# EAGLE design Qwiic_Spectral_Sensor_AS7341 (EAGLE 9.6.2)
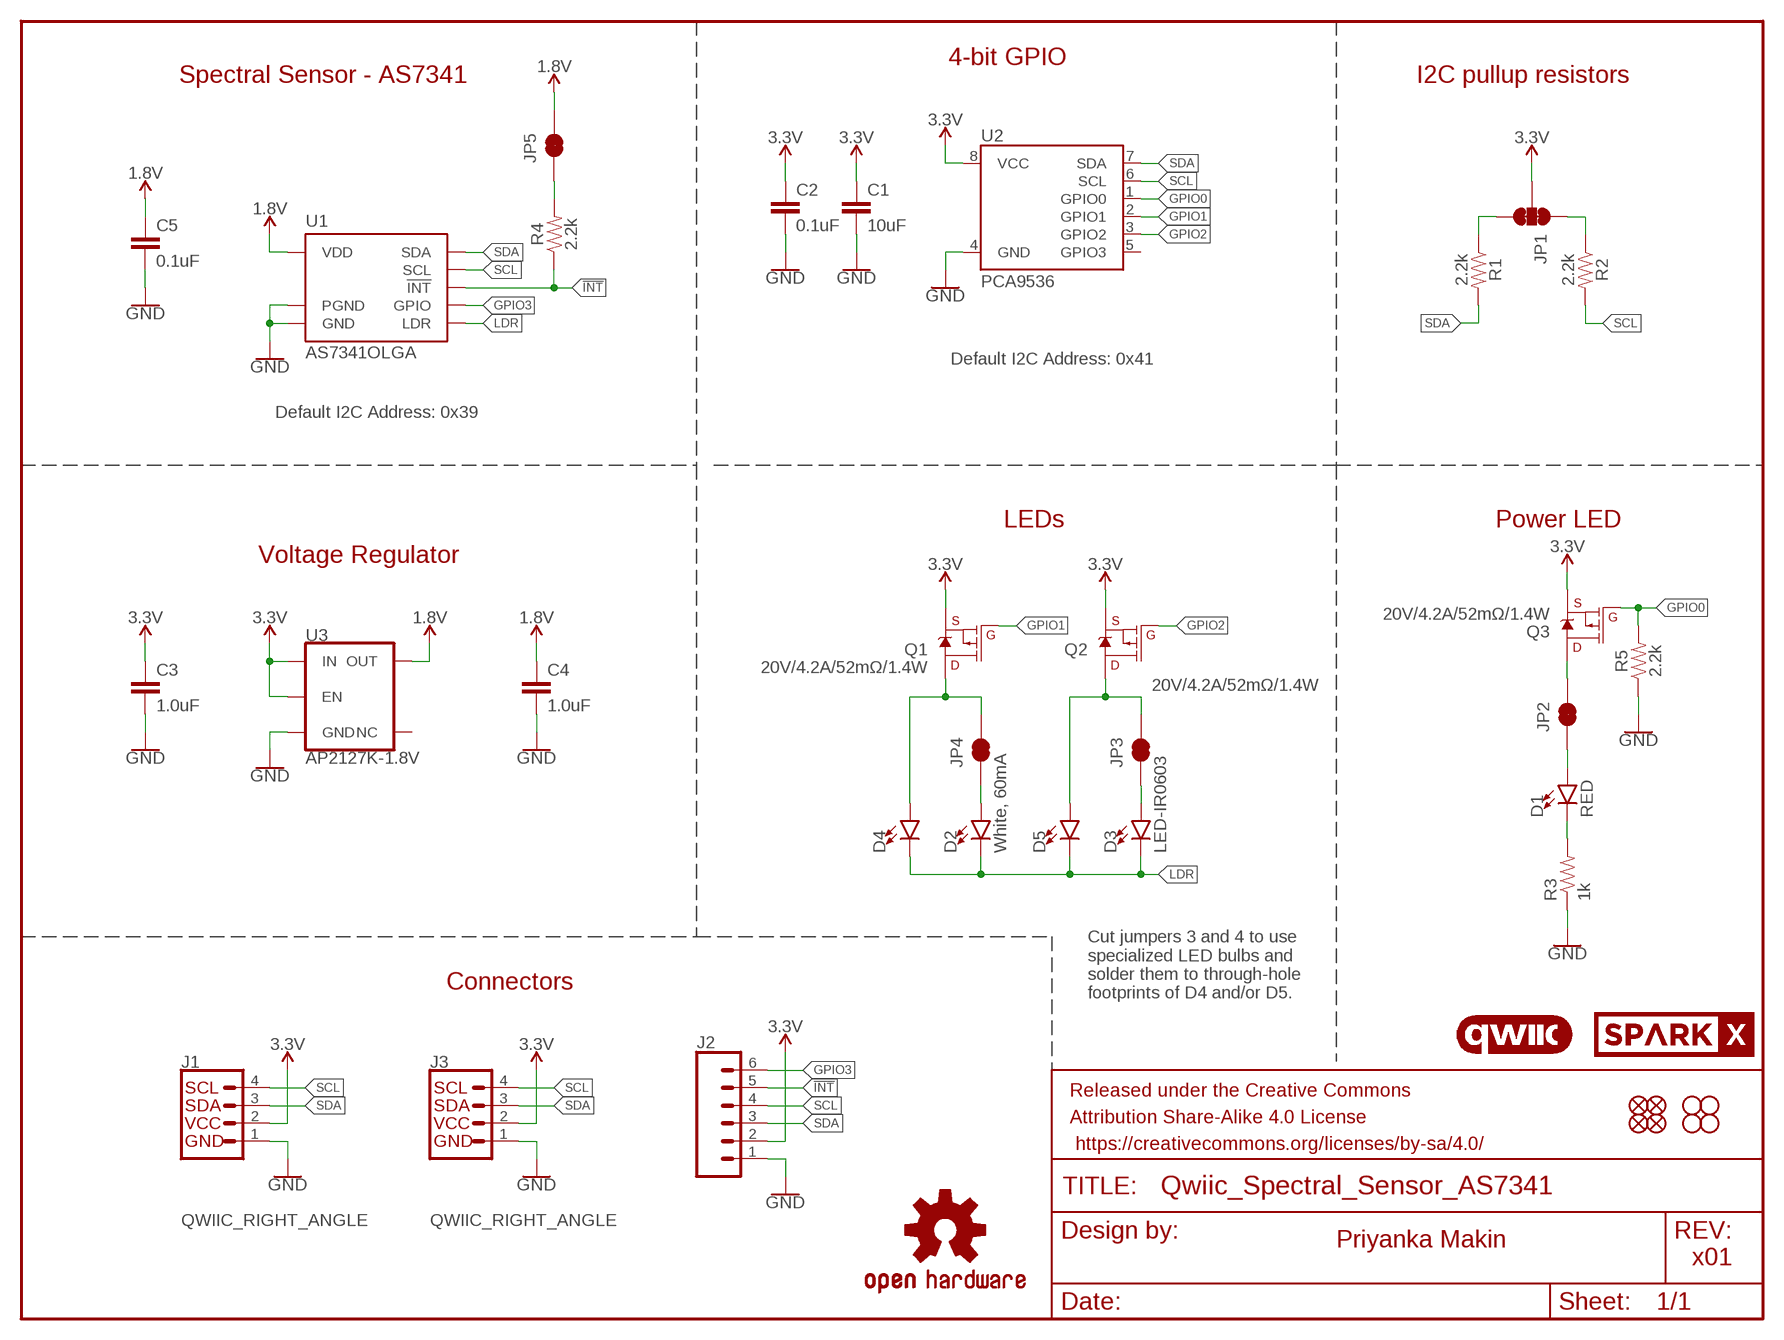
[diagram p0: schematic, sheet 1]

## Parts
C1  10uF  10UF-0603-6.3V-20%  [0603]
C2  0.1uF  0.1UF-0603-25V-(+80/-20%)  [0603]
C3  1.0uF  1.0UF-0603-16V-10%  [0603]
C4  1.0uF  1.0UF-0603-16V-10%  [0603]
C5  0.1uF  0.1UF-0603-25V-(+80/-20%)  [0603]
D1  RED  LED-RED0603  [LED-0603]
D2  White, 60mA  LED-WHITE3014  [SUPER_BRIGHT_SMD_LED_3014]
D3  LED-IR0603  [LED-0603]
D4  LED-3MM-NO_SILK  [LED_3MM-NS]
D5  LED-3MM-NO_SILK  [LED_3MM-NS]
FD1  FIDUCIAL1X2  [FIDUCIAL-1X2]
FD2  FIDUCIAL1X2  [FIDUCIAL-1X2]
FD3  FIDUCIAL1X2  [FIDUCIAL-1X2]
FD4  FIDUCIAL1X2  [FIDUCIAL-1X2]
FRAME1  FRAME-LETTER  [CREATIVE_COMMONS]
H1  STAND-OFF  [STAND-OFF]
H2  STAND-OFF  [STAND-OFF]
H3  STAND-OFF  [STAND-OFF]
H4  STAND-OFF  [STAND-OFF]
J1  QWIIC_RIGHT_ANGLE  QWIIC_CONNECTORJS-1MM  [JST04_1MM_RA]
J2  CONN_06NO_SILK_FEMALE_PTH  [1X06_NO_SILK]
J3  QWIIC_RIGHT_ANGLE  QWIIC_CONNECTORJS-1MM  [JST04_1MM_RA]
JP1  JUMPER-SMT_3_2-NC_TRACE_SILK  [SMT-JUMPER_3_2-NC_TRACE_SILK]
JP2  JUMPER-SMT_2_NC_TRACE_SILK  [SMT-JUMPER_2_NC_TRACE_SILK]
JP3  JUMPER-SMT_2_NC_TRACE_SILK  [SMT-JUMPER_2_NC_TRACE_SILK]
JP4  JUMPER-SMT_2_NC_TRACE_SILK  [SMT-JUMPER_2_NC_TRACE_SILK]
JP5  JUMPER-SMT_2_NC_TRACE_SILK  [SMT-JUMPER_2_NC_TRACE_SILK]
LOGO1  QWIIC_LOGO_6MM  [QWIIC_6MM]
Q1  20V/4.2A/52mΩ/1.4W  MOSFET_PCH-DMG2305UX-7  [SOT23-3]
Q2  20V/4.2A/52mΩ/1.4W  MOSFET_PCH-DMG2305UX-7  [SOT23-3]
Q3  20V/4.2A/52mΩ/1.4W  MOSFET_PCH-DMG2305UX-7  [SOT23-3]
R1  2.2k  2.2KOHM-0603-1/10W-1%  [0603]
R2  2.2k  2.2KOHM-0603-1/10W-1%  [0603]
R3  1k  1KOHM-0603-1/10W-1%  [0603]
R4  2.2k  2.2KOHM-0603-1/10W-1%  [0603]
R5  2.2k  2.2KOHM-0603-1/10W-1%  [0603]
U1  AS7341OLGA  [OLGA8]
U2  PCA9536  [MSOP8]
U3  AP2127K-1.8V  V_REG_AP2127K-1.8V  [SOT23-5]
U$1  OSHW-LOGOS  [OSHW-LOGO-S]
U$31  SPARKX-LOGO3  [SPARKX-SMALL]

## Nets
1.8V: C4.1 C5.1 JP5.2 U1.1(VDD) U3.5(OUT)
3.3V: C1.1 C2.1 C3.1 J1.2 J2.2 J3.2 JP1.2 Q1.2(S) Q2.2(S) Q3.2(S) U2.8(VCC) U3.1(IN) U3.3(EN)
!INT!: J2.5 R4.1 U1.7(!INT!)
GND: C1.2 C2.2 C3.2 C4.2 C5.2 J1.1 J2.1 J3.1 R3.1 R5.1 U1.3(GND) U1.5(PGND) U2.4(GND) U3.2(GND)
GPIO0: Q3.1(G) R5.2 U2.1(GPIO0)
GPIO1: Q1.1(G) U2.2(GPIO1)
GPIO2: Q2.1(G) U2.3(GPIO2)
GPIO3: J2.6 U1.6(GPIO)
LDR: D2.C D3.C D4.K(C) D5.K(C) U1.4(LDR)
N$1: JP1.3 R1.1
N$2: D1.C R3.2
N$3: JP1.1 R2.1
N$4: D1.A JP2.1
N$5: D2.A JP4.1
N$6: JP2.2 Q3.3(D)
N$7: D3.A JP3.1
N$8: D4.A JP4.2 Q1.3(D)
N$9: D5.A JP3.2 Q2.3(D)
N$10: JP5.1 R4.2
SCL: J1.4 J2.4 J3.4 R2.2 U1.2(SCL) U2.6(SCL)
SDA: J1.3 J2.3 J3.3 R1.2 U1.8(SDA) U2.7(SDA)
Unconnected: U2.5(GPIO3) U3.4(NC)

## Notes on the sheet
- 4-bit GPIO
- Spectral Sensor - AS7341 | I2C pullup resistors
- Default I2C Address: 0x41
- Default I2C Address: 0x39
- LEDs | Power LED
- Voltage Regulator
- Connectors
- Cut jumpers 3 and 4 to use 
  specialized LED bulbs and 
  solder them to through-hole 
  footprints of D4 and/or D5.
- Priyanka Makin
- x01

## Library data of the parts
C1 = SparkFun-Capacitors:10UF: 10.0µF ceramic capacitors A capacitor is a passive two-terminal electrical component used to store electrical energy temporarily in an electric field.; PROD_ID: CAP-11015
C2 C5 = SparkFun-Capacitors:0.1UF: 0.1µF ceramic capacitors A capacitor is a passive two-terminal electrical component used to store electrical energy temporarily in an electric field.; PROD_ID: CAP-00810
C3 C4 = SparkFun-Capacitors:1.0UF: 1µF ceramic capacitors A capacitor is a passive two-terminal electrical component used to store electrical energy temporarily in an electric field.; PROD_ID: CAP-00868
D1 = SparkFun-LED:LED-RED: Red SMD LED Used in manufacturing of most products at SparkFun Packages: 0603 - SMD 0603 package [Product Link] <http://docs.avagotech.com/docs/AV02-0551EN> 0603 SMART - SMD 0603 SMART package ( more efficient and expensive)[Product Link] <http://www.osram-os.com/Graphics/XPic2/00077099_0.pdf> 1206 - SMD1206 package [Product Link] <https://www.sparkfun.com/datasheets/DevTools/LilyPad/Q150OVS4.pdff> SparkFun Products: Pro Mini 328 -5V <https://www.sparkfun.com/products/821> RedBoard <https://www.sparkfun.com/products/12757> IOIO-OTG <https://www.sparkfun.com/products/13613>; PROD_ID: DIO-00819
D2 = SparkFun-LED:LED-WHITE: White SMD LED Used in manufacturing several products at SparkFun. Packages: 0603 - Bright White SMD 0603 package[Product Link] <http://www.kingbrightusa.com/product.asp?catalog_name=LED&product_id=APT1608QWF/D> 1206 - Bright White SMD1206 package [Product Link] <http://www.kingbrightusa.com/product.asp?catalog_name=LED&product_id=APT3216QWF/D> 3014 - Super Bright SMD 3014 package [Datasheet] <http://www.lumileds.com/uploads/459/DS208-pdf> SparkFun Products: Blackberry Trackballer Breakout <https://www.sparkfun.com/products/13169> Digital SandBox <https://www.sparkfun.com/products/12651>; PROD_ID: DIO-13728
D3 = SparkFun-LED:LED-IR: Infrared LED (IR) Wavelength: 940nm Packages: TSAL6100 LTE302 - Side firing. Check SparkFun-Sensors.lbr for the receiver SparkFun Products: ZX Distance and Gesture Sensor <[https://www.sparkfun.com/products/12780]> Infrared Emitters and Detectors <https://www.sparkfun.com/products/241>; PROD_ID: DIO-14125
D4 D5 = SparkFun-LED:LED: LED (Generic) Standard schematic elements and footprints for 5mm, 3mm, 1206, and 0603 sized LEDs. Generic LEDs with no color specified.
FD1-FD4 = SparkFun-Aesthetics:FIDUCIAL: Fiducial Alignment Points Point-of-reference for pick-and-place machines and other optical instruments.
FRAME1 = SparkFun-Aesthetics:FRAME-LETTER: Schematic Frame - Letter Standard 8.5x11 US Letter frame
H1-H4 = SparkFun-Hardware:STAND-OFF: Stand Off Drill holes for mechanically mounting via screws, standoffs, etc. Note: Use the keepout ring to avoid running the screw head into surrounding components. Variant Overviews STAND-OFF - Mechanical footprint for a #4 phillips button head screw. STAND-OFF-TIGHT - Mechanical footprint for a #4 phillips button head screw, Example SparkFun Products Screw - Phillips Head (1/4", 4-40, 10 pack) <https://www.sparkfun.com/products/10453> (PRT-10453) Screw - Phillips Head (1/2", 4-40, 10 pack) <https://www.sparkfun.com/products/10452> (PRT-10452) Screw - Phillips Head (3/4", 4-40, 10 pack) <https://www.sparkfun.com/products/10451> (PRT-10451) Screw - Phillips Head (1", 4-40, 10 pack) <https://www.sparkfun.com/products/10450> (PRT-10450)
J1 J3 = SparkFun-Connectors:QWIIC_CONNECTOR: SparkFun I2C Standard Qwiic Connector An SMD 1mm pitch JST connector makes it easy and quick (get it? Qwiic?) to connect I2C devices to each other. The Qwiic system <http://www.sparkfun.com/qwiic> enables fast and solderless connection between popular platforms and various sensors and actuators. We carry 200mm <https://www.sparkfun.com/products/14204>, 100mm <https://www.sparkfun.com/products/14205>, 50mm <https://www.sparkfun.com/products/14206>, and breadboard friendly <https://www.sparkfun.com/products/14207> Qwiic cables. We also offer 10 pcs strips <https://www.sparkfun.com/products/14323> the SMD connectors.; PROD_ID: CONN-13694
J2 = SparkFun-Connectors:CONN_06: Multi connection point. Often used as Generic Header-pin footprint for 0.1 inch spaced/style header connections On any of the 0.1 inch spaced packages, you can populate with these: Break Away Headers - Straight <https://www.sparkfun.com/products/116> (PRT-00116) Break Away Male Headers - Right Angle <https://www.sparkfun.com/products/553> (PRT-00553) Female Headers <https://www.sparkfun.com/products/115> (PRT-00115) Break Away Headers - Machine Pin <https://www.sparkfun.com/products/117> (PRT-00117) Break Away Female Headers - Swiss Machine Pin <https://www.sparkfun.com/products/743> (PRT-00743) Arduino Stackable Header - 6 Pin <https://www.sparkfun.com/products/9280> (PRT-09280) For SCREWTERMINALS and SPRING TERMINALS visit here: Screw Terimnals on SparkFun.com <https://www.sparkfun.com/search/results?term=Screw+Terminals> (5mm/3.5mm/2.54mm spacing) This device is also useful as a general connection point to wire up your design to another part of your project. Our various solder wires solder well into these plated through hole pads. Hook-Up Wire - Assortment (Stranded, 22 AWG) <https://www.sparkfun.com/products/11375> (PRT-11375) Hook-Up Wire - Assortment (Solid Core, 22 AWG) <https://www.sparkfun.com/products/11367> (PRT-11367) View the entire wire category on our website here <https://www.sparkfun.com/categories/141>; PROD_ID: CONN-08437
JP1 = SparkFun-Jumpers:JUMPER-SMT_3_2-NC_TRACE: Normally closed trace jumper (2 of 2 connections) This jumper has a trace between all three pads so they are normally closed (NC). Use a razor knife to open the connection(s). For best results follow the IPC guidelines for cutting traces: Cutout at least 0.063 mm (0.005 in). Remove all loose material to clean up the cut area. Seal the cut with an approved epoxy. Reapply solder to reclose the connection(s).
JP2-JP5 = SparkFun-Jumpers:JUMPER-SMT_2_NC_TRACE: Normally closed trace jumper This jumper has a trace between two pads so it's normally closed (NC). Use a razor knife to open the connection. For best results follow the IPC guidelines for cutting traces: Cutout at least 0.063 mm (0.005 in). Remove all loose material to clean up the cut area. Seal the cut with an approved epoxy. Reapply solder to reclose the connection.
LOGO1 = SparkFun-Aesthetics:QWIIC_LOGO: Qwiic Logos for placement on schematic and PCB. The 5.5mm silk logo is best for placing next to Qwiic connector.
Q1-Q3 = SparkFun-DiscreteSemi:MOSFET_PCH: P-channel MOSFETs Voltage controlled devices that allow control of high current outputs. SparkFun Products: SparkFun ESP32 Thing <https://www.sparkfun.com/products/13907> SparkFun ESP8266 Thing <https://www.sparkfun.com/products/13231> SparkFun Pi Servo HAT V2 <https://www.sparkfun.com/products/15316> DMG2305UX-7 (20V/4.2A/SOT23-3); PROD_ID: TRAN-14388
R1 R2 R4 R5 = SparkFun-Resistors:2.2KOHM: 2.2kΩ resistor A resistor is a passive two-terminal electrical component that implements electrical resistance as a circuit element. Resistors act to reduce current flow, and, at the same time, act to lower voltage levels within circuits. - Wikipedia; PROD_ID: RES-08272
R3 = SparkFun-Resistors:1KOHM: 1kΩ resistor A resistor is a passive two-terminal electrical component that implements electrical resistance as a circuit element. Resistors act to reduce current flow, and, at the same time, act to lower voltage levels within circuits. - Wikipedia; PROD_ID: RES-07856
U1 = AS7341:AS7341: The AS7341 is a spectral sensor. It has 8 channels spanning the visible spectrum, one IR, one clear, and one flicker channel for a total of 11 channels.
U2 = New_Parts:PCA9536: PCA9536 4-Bit I2C I/O Expander; PROD_ID: IC-15034
U3 = SparkFun-IC-Power:V_REG_AP2127: AP2127 - 300mA CMOS LDO Regulator w/ Enable The AP2127 is CMOS process low dropout linear regulator with enable function, the regulator delivers a guaranteed 300mA (min.) continuous load current. Features Output Voltage Accuracy: ±1.5% Output Current: 300mA (Min.) Foldback Short Current Protection: 50mA Enable Function to Turn ON/OFF VOUT Low Dropout Voltage (3.3V): 250mV (Typ.) @IOUT=600mA Excellent Load Regulation: 0.2%/A (Typ.) Excellent Line Regulation: 0.02%/V (Typ.) Low Quiescent Current: 55μA (Typ.) Low Standby Current: 0.01μA (Typ.) Low Output Noise: 50μVRMS PSRR: 100Hz -65dB, 1kHz -65dB OTSD Protection Stable with 1.0μF Flexible Cap: Ceramic, Tantalum and Aluminum Electrolytic Operation Temperature Range: -40°C to 85°C ESD: MM 400V, HBM 4000V; PROD_ID: VREG-14239
U$1 = SparkFun-Aesthetics:OSHW-LOGO: Open-Source Hardware (OSHW) Logo This logo indicates the piece of hardware it is found on incorporates a OSHW license and/or adheres to the definition of open source hardware found here: http://freedomdefined.org/OSHW
U$31 = SparkX:SPARKX-LOGO

## Board
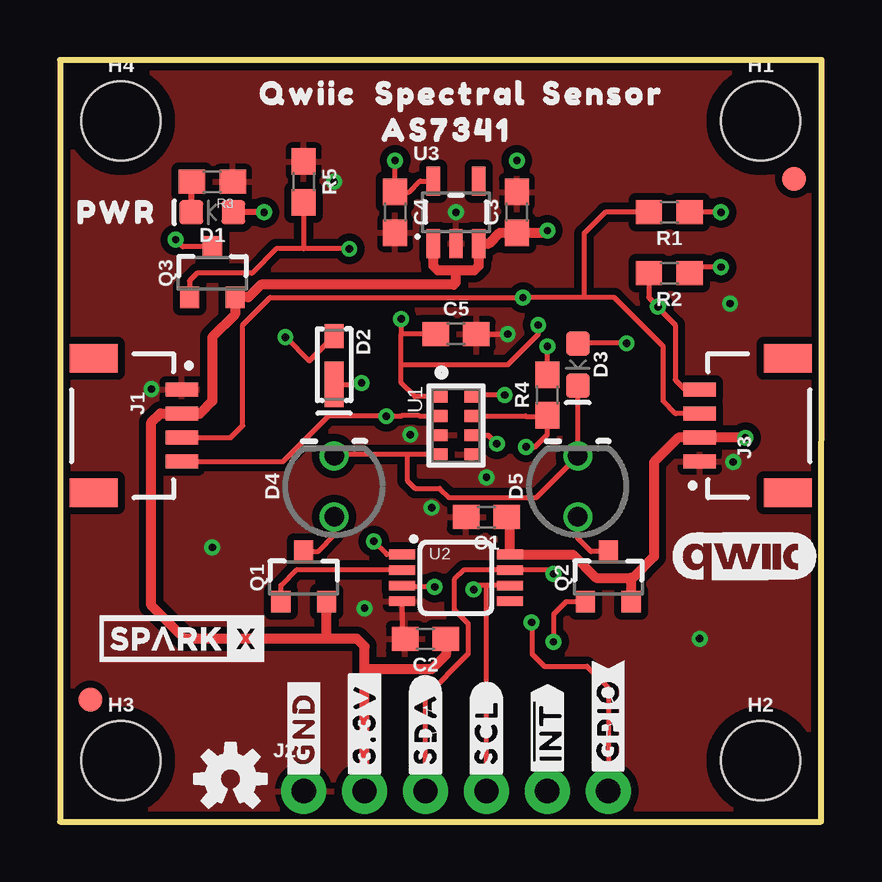
[diagram p1: board, top side]
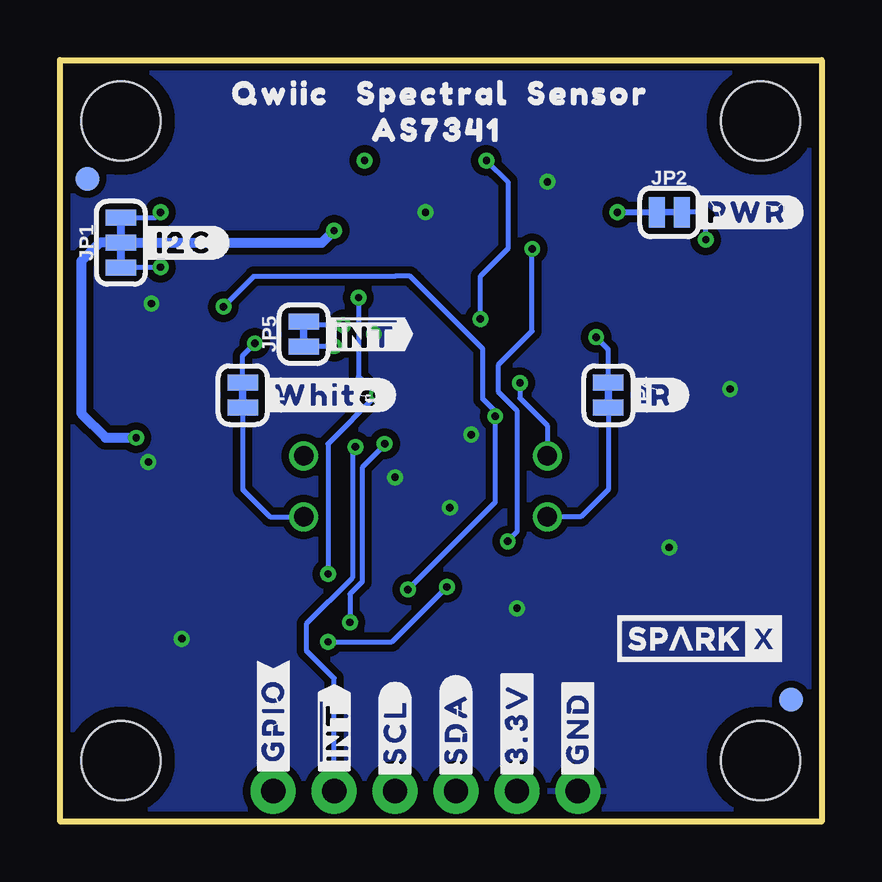
[diagram p2: board, bottom side, seen from below]

Size 31.75 x 31.75 mm. Coordinates in mm from the lower left corner, seen from the top.
Outline: 0,0 31.73,0 31.75,31.75 0,31.75 0,0
Copper layers (1*16): Top 0.035mm / dielectric 1.5mm / Bottom 0.035mm
Design rules "SparkFun-2-layer-TIGHT *": minimum track width 7mil, minimum drill 12mil, track to track 7mil, track to pad 7mil, pad to pad 7mil, via to via 7mil, smd to smd 7mil, copper to edge 7mil, drill to drill 7mil, minimum pad ring 7mil, minimum via ring 7mil, stop-mask expansion 4mil, vias tented up to drill 25mil, thermal gap 10mil

### Footprints (pad centres in the part's own frame; a part is rotated, then mirrored left to right if it is on the bottom)
0603 = smd 1.1 x 1: 1 -0.85,0; 2 0.85,0
LED-0603 = smd 1 x 1: A -0.877,0; C 0.877,0
SUPER_BRIGHT_SMD_LED_3014 = smd 1 x 0.8: A -1.2,0 | smd 1.9 x 0.8: C 0.827,0
LED_3MM-NS = drill 0.813: A -1.27,0; K 1.27,0
FIDUCIAL-1X2 = smd 1 x 1: 1 0,0
STAND-OFF = hole 3.302: 0,0
JST04_1MM_RA = smd 0.6 x 1.35: 1 -1.5,0; 2 -0.5,0; 3 0.5,0; 4 1.5,0 | smd 1.2 x 2: NC1 2.8,-3.675; NC2 -2.8,-3.675
1X06_NO_SILK = drill 1.016 pad 1.88: 1 0,0; 2 2.54,0; 3 5.08,0; 4 7.62,0; 5 10.16,0; 6 12.7,0
SMT-JUMPER_3_2-NC_TRACE_SILK = smd 0.66 x 1.27: 1 -1.041,0; 2 0,0; 3 1.041,0
SMT-JUMPER_2_NC_TRACE_SILK = smd 0.66 x 1.27: 1 -0.521,0; 2 0.521,0
SOT23-3 = smd 0.8 x 0.9: 1 -0.95,-1; 2 0.95,-1; 3 0,1.1
OLGA8 = smd 0.488 x 0.575: 1 -1.2,-0.638; 2 -0.4,-0.638; 3 0.4,-0.638; 4 1.2,-0.638; 5 1.2,0.638; 6 0.4,0.638; 7 -0.4,0.638; 8 -1.2,0.638
MSOP8 = smd 1.1 x 0.4: 1 -2.25,0.975; 2 -2.25,0.325; 3 -2.25,-0.325; 4 -2.25,-0.975; 5 2.25,-0.975; 6 2.25,-0.325; 7 2.25,0.325; 8 2.25,0.975
SOT23-5 = smd 0.55 x 1.2: 1 -0.95,-1.3; 2 0,-1.3; 3 0.95,-1.3; 4 0.95,1.3; 5 -0.95,1.3

### Placement (x,y rotation side)
C1  17.78,12.7 180 top
C2  15.24,7.62 180 top
C3  19.05,25.4 90 top
C4  13.97,25.4 270 top
C5  16.51,20.32 0 top
D1  6.35,25.4 180 top
D2  11.43,19.05 270 top
D3  21.59,19.05 270 top
D4  11.43,13.97 90 top
D5  21.59,13.97 90 top
FD1  1.27,5.08 0 top
FD2  30.61,26.8 0 top
FD3  1.27,5.08 0 bottom
FD4  30.61,26.8 0 bottom
FRAME1  20.32,-7.62 0 top  (outside the outline)
H1  29.21,29.21 0 top
H2  29.21,2.54 0 top
H3  2.54,2.54 0 top
H4  2.54,29.21 0 top
J1  5.08,16.51 270 top
J2  10.16,1.27 0 top
J3  26.67,16.51 90 top
JP1  29.21,24.13 90 bottom
JP2  6.35,25.4 0 bottom
JP3  24.13,17.78 270 bottom
JP4  8.89,17.78 270 bottom
JP5  21.59,20.32 90 bottom
LOGO1  28.57,11.05 0 top
Q1  10.16,10.16 0 top
Q2  22.86,10.16 0 top
Q3  6.35,22.86 0 top
R1  25.4,25.4 180 top
R2  25.4,22.86 180 top
R3  6.35,26.67 180 top
R4  20.32,17.78 90 top
R5  10.16,26.67 270 top
U1  16.51,16.51 270 top
U2  16.51,10.16 0 top
U3  16.51,25.4 0 top
U$1  7.11,1.78 0 top
U$3  [QWIIC0]  7.62,30.35 0 top
U$4  [QWIIC0]  25.27,30.35 0 bottom
U$5  [SPECTRAL0]  12.45,30.35 0 top
U$7  [SPARKX-SMALL]  5.08,7.62 0 bottom
U$8  [SPECTRAL0]  20.07,30.35 0 bottom
U$9  [#I2C#0]  28.45,24.13 0 bottom
U$10  [#PWR#0]  5.46,25.4 0 bottom
U$11  [SENSOR0]  19.43,30.35 0 top
U$12  [PWR0]  0,25.4 0 top
U$13  [#GND#0]  10.16,1.65 90 top
U$14  [#GND#0]  10.16,1.65 90 bottom
U$15  [#3#3V#0]  12.7,1.65 90 top
U$16  [#3#3V#0]  12.7,1.65 90 bottom
U$17  [#SDA#0]  15.24,1.65 90 top
U$18  [#SDA#0]  15.24,1.65 90 bottom
U$19  [#SCL#0]  17.78,1.65 90 top
U$20  [#SCL#0]  17.78,1.65 90 bottom
U$21  [SENSOR0]  12.95,30.35 0 bottom
U$22  [AS73410]  12.7,28.83 0 top
U$23  [AS73410]  19.43,28.83 0 bottom
U$24  [##INT##0]  20.32,1.78 90 top
U$25  [##INT##0]  20.32,1.78 90 bottom
U$26  [#GPIO#0]  22.86,1.78 90 top
U$27  [#GPIO#0]  22.86,1.78 90 bottom
U$28  [#IR#0]  8.26,17.78 0 bottom
U$29  [#WHITE#0]  23.5,17.78 0 bottom
U$30  [##INT##0]  20.95,20.32 0 bottom
U$31  5.08,7.62 0 top

### Tracks (layer width: path | path; a pad name or v marks a point on that pad's centre or on a via)
1.8V  (via drill 0.3)
  Top 0.203: U1.1 14.8,17.71 14.22,18.29 14.22,19.05 | 14.22,19.05 14.22,20.32 | 14.22,19.05 18.67,19.05 19.94,20.32 v19.94,20.7 | U3.5 15.02,26.7 14.57,26.25 C4.1 v13.97,27.56 | v14.22,20.95 14.22,20.32 | C5.1 14.22,20.32
  Bottom 0.203: v14.22,20.95 14.22,22.73 13.08,23.88 13.08,26.67 v13.97,27.56 | v19.94,20.7 21.45,20.7 JP5.2
3.3V  (via drill 0.3)
  Top 0.203: J1.2 5.33,17.01 5.33,17.02 | 18.76,12.57 C1.1 | J3.2 26.54,16.01 26.55,16 | 23.88,10.16 23.81,10.16
  Top 0.406: 5.33,17.01 5.83,17.01 6.35,17.53 6.35,20.19 7.3,21.14 Q3.2 7.86,21.86 8.38,22.38 16.41,22.38 16.51,22.48 16.51,22.99 | 5.33,17.02 4.19,17.02 3.81,16.64 3.81,9.02 5.21,7.62 11.11,7.62 | C2.1 16.09,6.95 15.49,6.35 12.7,6.35 | 11.11,7.62 Q1.2 | 11.11,7.62 12.38,7.62 12.7,7.3 12.7,6.35 | J2.2 12.7,6.35 | 18.76,12.57 U2.8 21.38,11.13 22.35,10.16 23.81,10.16 Q2.2 | 26.54,16.01 25.79,16.01 24.77,14.99 24.77,11.05 23.88,10.16 | U3.1 15.56,23.18 15.75,22.99 16.51,22.99 | 16.51,22.99 17.27,22.99 17.46,23.18 U3.3 17.88,24.1 18.33,24.55 C3.1 20.23,24.55 v20.32,24.64 | v28.57,16 26.55,16
  Bottom 0.406: v28.57,16 29.84,16 30.86,17.02 30.86,23.37 30.1,24.13 JP1.2 20.83,24.13 v20.32,24.64
!INT!  (via drill 0.3)
  Top 0.203: U1.7 19.41,16.91 19.43,16.89 20.28,16.89 R4.1 20.32,16.13 19.81,15.62 v19.43,15.62
  Bottom 0.203: J2.5 20.32,5.97 21.46,7.11 21.46,8.26 19.56,10.16 19.56,15.49 v19.43,15.62
GND  (via drill 0.3)
  Top 0.203: C5.2 v18.67,20.32 | U2.4 14.26,7.75 C2.2
  other vias: 11.43,26.67 15.49,13.08 6.35,11.43 26.67,7.62 27.94,21.59 14.61,16.13 12.7,8.89 17.78,14.35 3.81,18.03 16.51,25.4 28.07,14.99
  pour Top (isolate 0.305): 0,31.75 0,0 31.75,0 31.75,31.75
  pour Bottom (isolate 0.305): 0,31.75 0,0 31.75,0 31.75,31.75
GPIO0  (via drill 0.3)
  Top 0.203: U2.1 13.63,11.13 v13.08,11.68 | R5.2 10.16,23.88 | v12.06,23.88 10.16,23.88 | 10.16,23.88 9.02,23.88 8,22.86 5.71,22.86 5.4,22.55 Q3.1
  Bottom 0.203: v13.08,11.68 12.7,12.06 12.7,17.14 13.46,17.91 13.46,19.05 12.06,20.45 v12.06,23.88
GPIO1
  Top 0.203: U2.2 9.85,10.48 9.21,9.85 Q1.1
GPIO2  (via drill 0.3)
  Top 0.203: Q2.1 21.1,9.16 20.57,8.64 v20.57,7.49 | v15.62,9.78 14.32,9.78 U2.3
  Bottom 0.203: v20.57,7.49 17.91,7.49 v15.62,9.78
GPIO3  (via drill 0.3)
  Top 0.203: J2.6 22.86,5.59 21.97,6.48 20.19,6.48 19.68,6.99 19.68,8.26 19.68,8.28 v19.66,8.31 | U1.6 17.85,16.11 v18.21,15.75
  Bottom 0.203: v18.21,15.75 18.21,15.69 19.15,14.75 19.15,10.16 19.15,9.99 19.66,9.48 v19.66,8.31
LDR  (via drill 0.3)
  Top 0.203: D4.K 11.43,15.37 11.49,15.31 14.48,15.31 | U1.4 14.48,15.31 | D3.C D5.K 19.86,13.51 16.22,13.51 15.83,13.89 14.81,13.89 14.48,14.22 14.48,15.31 | D2.C 12.51,18.22 v12.57,18.29
  Bottom 0.203: v12.57,18.29 12.57,17.65 11.43,16.51 D4.K
N$1  (via drill 0.3)
  Top 0.203: v27.56,25.4 R1.1
  Bottom 0.203: JP1.3 27.79,25.17 v27.56,25.4
N$2
  Top 0.254: R3.2 5.47,26.64 D1.C
N$3  (via drill 0.3)
  Top 0.203: v27.56,23.11 26.5,23.11 R2.1
  Bottom 0.203: JP1.1 29.18,23.11 v27.56,23.11
N$4  (via drill 0.3)
  Top 0.254: v8.51,25.4 D1.A
  Bottom 0.254: v8.51,25.4 JP2.1
N$5  (via drill 0.3)
  Top 0.203: v9.4,20.19 10.39,19.21 D2.A
  Bottom 0.203: JP4.1 8.89,19.68 v9.4,20.19
N$6  (via drill 0.3)
  Top 0.203: Q3.3 5.12,23.96 v4.83,24.26
  Bottom 0.203: v4.83,24.26 4.83,25.15 5.08,25.4 JP2.2
N$7  (via drill 0.3)
  Top 0.203: v23.62,19.94 21.6,19.94 D3.A
  Bottom 0.203: JP3.1 24.13,19.43 v23.62,19.94
N$8
  Top 0.203: Q1.3 10.75,11.26 11.43,11.94 D4.A
  Bottom 0.203: D4.A 10.03,12.7 8.89,13.84 JP4.2
N$9
  Top 0.203: Q2.3 22.14,11.26 21.59,11.81 D5.A
  Bottom 0.203: JP3.2 24.13,13.84 22.99,12.7 D5.A
N$10  (via drill 0.3)
  Top 0.203: R4.2 v20.32,19.81
  Bottom 0.203: v20.32,19.81 21.58,19.81 JP5.1
N$13  (via drill 0.3)
  other vias: 19.05,27.56
SCL  (via drill 0.3)
  Top 0.203: J1.4 9.29,15.01 11.2,16.91 11.21,16.9 v13.6,16.9 14.22,16.9 14.27,16.94 14.94,16.94 14.97,16.91 U1.2 | U2.6 17.78,9.84 | J2.4 17.78,9.84 | 17.78,9.84 17.41,9.84 v17.25,9.67 | R2.2 24.55,21.84 v24.93,21.46 24.93,21.42 25.65,20.7 25.65,18.41 26.06,18.01 J3.4
  Bottom 0.203: v17.25,9.67 13.6,13.32 v13.6,16.9 13.6,17.09 14.12,17.61 14.12,19.7 16.89,22.48 17.02,22.6 17.15,22.73 17.78,22.73 23.66,22.73 v24.93,21.46
SDA  (via drill 0.3)
  Top 0.203: J1.3 7.12,16.01 7.62,16.51 7.62,20.7 8.76,21.84 v19.3,21.84 21.84,21.84 | v18.54,17.78 17.22,17.78 U1.8 | J2.3 15.24,5.21 17.02,6.99 17.02,8.26 16.43,8.84 16.43,10.08 16.84,10.48 U2.7 20.41,10.48 v20.57,10.32 | J3.3 25.66,17.01 25.15,17.53 25.15,19.81 23.11,21.84 21.84,21.84 | R1.2 22.73,25.4 21.84,24.51 21.84,21.84
  Bottom 0.203: v19.3,21.84 19.3,18.54 v18.54,17.78 20.57,15.75 v20.57,10.32

### Text on the board
tDocu: Priyanka Makin